# EAGLE schematic fmcboard_v1.6s (EAGLE 9.6.2)

## Sheet 1 of 5: Power, IO, Arduino
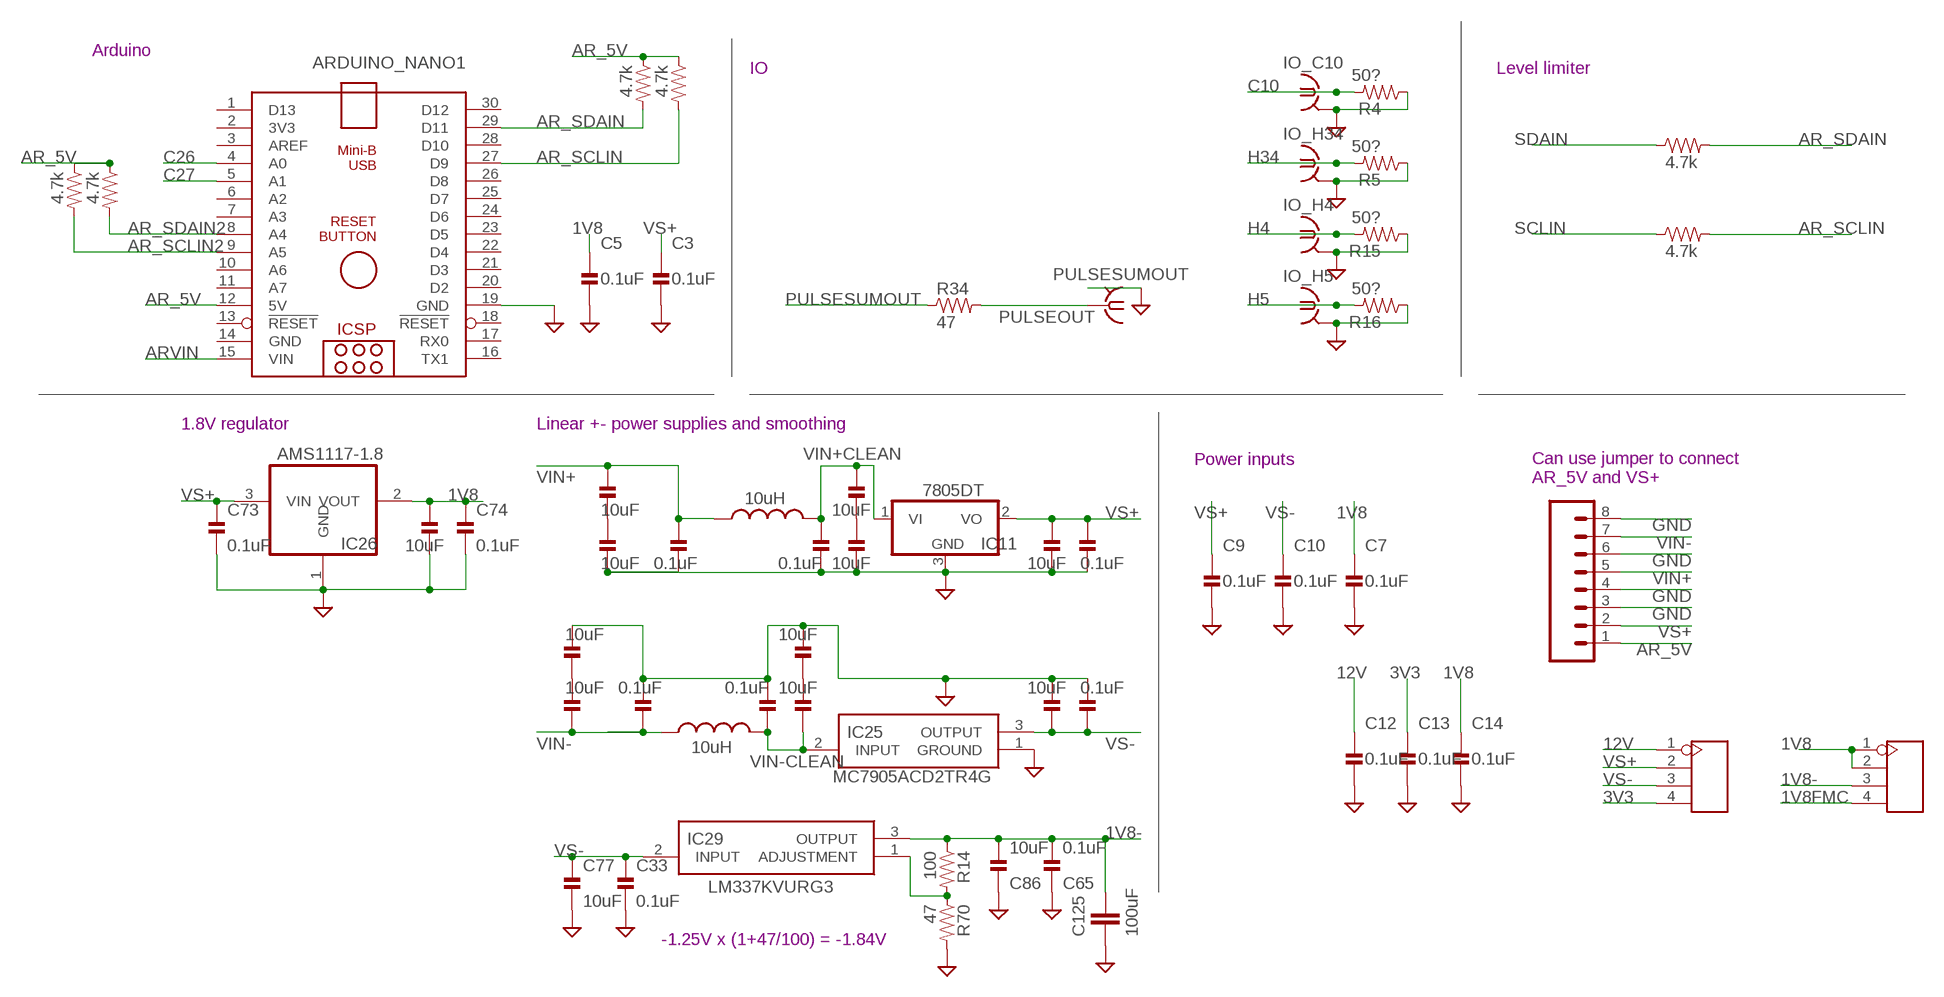
[diagram p0: schematic, sheet 1]

### Parts
ARDUINO_NANO1  1  ARDUINO_NANO  [ARDUINO_NANO]
C1  10uF  CAPACITOR0402_CAP  [0402_CAP]
C2  10uF  CAPACITOR0402_CAP  [0402_CAP]
C3  0.1uF  CAPACITOR0402_CAP  [0402_CAP]
C5  0.1uF  CAPACITOR0402_CAP  [0402_CAP]
C7  0.1uF  CAPACITOR0402_CAP  [0402_CAP]
C9  0.1uF  CAPACITOR0402_CAP  [0402_CAP]
C10  0.1uF  CAPACITOR0402_CAP  [0402_CAP]
C12  0.1uF  CAPACITOR0402_CAP  [0402_CAP]
C13  0.1uF  CAPACITOR0402_CAP  [0402_CAP]
C14  0.1uF  CAPACITOR0402_CAP  [0402_CAP]
C33  0.1uF  CAPACITOR0402_CAP  [0402_CAP]
C34  10uF  CAPACITOR0402_CAP  [0402_CAP]
C38  10uF  CAPACITOR0402_CAP  [0402_CAP]
C39  10uF  CAPACITOR0402_CAP  [0402_CAP]
C40  10uF  CAPACITOR0402_CAP  [0402_CAP]
C41  10uF  CAPACITOR0402_CAP  [0402_CAP]
C42  0.1uF  CAPACITOR0402_CAP  [0402_CAP]
C43  0.1uF  CAPACITOR0402_CAP  [0402_CAP]
C44  0.1uF  CAPACITOR0402_CAP  [0402_CAP]
C45  0.1uF  CAPACITOR0402_CAP  [0402_CAP]
C46  0.1uF  CAPACITOR0402_CAP  [0402_CAP]
C47  0.1uF  CAPACITOR0402_CAP  [0402_CAP]
C65  0.1uF  CAPACITOR0402_CAP  [0402_CAP]
C73  0.1uF  CAPACITOR0402_CAP  [0402_CAP]
C74  0.1uF  CAPACITOR0402_CAP  [0402_CAP]
C77  10uF  CAPACITOR0402_CAP  [0402_CAP]
C86  10uF  CAPACITOR0402_CAP  [0402_CAP]
C110  10uF  CAPACITOR0402_CAP  [0402_CAP]
C111  10uF  CAPACITOR0402_CAP  [0402_CAP]
C118  10uF  CAPACITOR0402_CAP  [0402_CAP]
C119  10uF  CAPACITOR0402_CAP  [0402_CAP]
C125  100uF  C-EUC1206K  [C1206K]
IC11  7805DT  [TO252]
IC25  MC7905ACD2TR4G  [MC7905ACD2TR4G]
IC26  AMS1117-1.8  REG1117  [SOT223]
IC29  LM337KVURG3  [LM337KVURG3]
IO_C10  BU-SMB-V  [BU-SMB-V]
IO_H4  BU-SMB-V  [BU-SMB-V]
IO_H5  BU-SMB-V  [BU-SMB-V]
IO_H34  BU-SMB-V  [BU-SMB-V]
J1  8pin  CONN_08"  [1X08]
J8  4p-2.54  DIP-BLACK-FEMALE-HEADER-VERT(4P-2.54)  [H4-2.54]
J12  4p-2.54  DIP-BLACK-FEMALE-HEADER-VERT(4P-2.54)  [H4-2.54]
L1  10uH  INDUCTOR1210  [1210]
L2  10uH  INDUCTOR1210  [1210]
PULSESUMOUT  BU-SMB-V  [BU-SMB-V]
R4  50?  RESISTOR0402_RES  [0402_RES]
R5  50?  RESISTOR0402_RES  [0402_RES]
R14  100  RESISTOR0402_RES  [0402_RES]
R15  50?  RESISTOR0402_RES  [0402_RES]
R16  50?  RESISTOR0402_RES  [0402_RES]
R34  47  RESISTOR0402_RES  [0402_RES]
R48  4.7k  RESISTOR0402_RES  [0402_RES]
R49  4.7k  RESISTOR0402_RES  [0402_RES]
R50  4.7k  RESISTOR0402_RES  [0402_RES]
R51  4.7k  RESISTOR0402_RES  [0402_RES]
R70  47  RESISTOR0402_RES  [0402_RES]
R87  4.7k  RESISTOR0402_RES  [0402_RES]
R90  4.7k  RESISTOR0402_RES  [0402_RES]

### Nets
1V8 [power]: C5.1 C7.1 C14.1 C34.1 C74.1 IC26.2(VOUT) J12.1 J12.2 ; also sheet 2,3
1V8-: C65.1 C86.1 C125.1 IC29.3(OUTPUT) J12.3 R14.1 ; also sheet 2
1V8FMC [power]: J12.4 ; also sheet 4
3V3 [power]: C13.1 J8.4 ; also sheet 4
12V [power]: C12.1 J8.1 ; also sheet 4,5
AR_5V [power]: ARDUINO_NANO1.12(5V) J1.1 R48.1 R49.1 R50.1 R51.1
AR_SCLIN: ARDUINO_NANO1.27(D9) R51.2 R90.2
AR_SCLIN2: ARDUINO_NANO1.9(A5) R49.2 ; also sheet 2
AR_SDAIN: ARDUINO_NANO1.29(D11) R50.2 R87.2
AR_SDAIN2: ARDUINO_NANO1.8(A4) R48.2 ; also sheet 2
ARVIN: ARDUINO_NANO1.15(VIN)
C10: IO_C10.1 R4.2 ; also sheet 2,4
C26: ARDUINO_NANO1.4(A0) ; also sheet 4
C27: ARDUINO_NANO1.5(A1) ; also sheet 4
GND [gnd]: ARDUINO_NANO1.19(GND) C1.2 C3.2 C5.2 C7.2 C9.2 C10.2 C12.2 C13.2 C14.2 C33.2 C34.2 C38.2 C39.1 C40.1 C42.2 C43.2 C44.1 C45.1 C46.1 C47.2 C65.2 C73.2 C74.2 C77.2 C86.2 C110.2 C119.1 C125.2 IC11.3(GND) IC25.1(GROUND) IC26.1(GND) IO_C10.2 IO_C10.3 IO_C10.4 IO_C10.5 IO_H4.2 IO_H4.3 IO_H4.4 IO_H4.5 IO_H5.2 IO_H5.3 IO_H5.4 IO_H5.5 IO_H34.2 IO_H34.3 IO_H34.4 IO_H34.5 J1.3 J1.4 J1.6 J1.8 PULSESUMOUT.2 PULSESUMOUT.3 PULSESUMOUT.4 PULSESUMOUT.5 R4.1 R5.1 R15.1 R16.1 R70.2 ; also sheet 2,3,4,5
H4: IO_H4.1 R15.2 ; also sheet 4
H5: IO_H5.1 R16.2 ; also sheet 4
H34: IO_H34.1 R5.2 ; also sheet 2,4
N$30: IC29.1(ADJUSTMENT) R14.2 R70.1
N$38: C1.1 C118.2
N$39: C41.1 C119.2
N$58: C2.2 C110.1
N$59: C40.2 C111.1
PULSEOUT: PULSESUMOUT.1 R34.2 ; also sheet 3
PULSESUMOUT: R34.1 ; also sheet 3
SCLIN: R90.1 ; also sheet 4
SDAIN [power]: R87.1 ; also sheet 4
VIN+ [power]: C42.1 C118.1 J1.5 L1.1 ; also sheet 5
VIN+CLEAN [power]: C2.1 C43.1 IC11.1(VI) L1.2
VIN- [power]: C41.2 C44.2 J1.7 L2.1 ; also sheet 5
VIN-CLEAN [power]: C45.2 C111.2 IC25.2(INPUT) L2.2
VS+ [power]: C3.1 C9.1 C38.1 C47.1 C73.1 IC11.2(VO) IC26.3(VIN) J1.2 J8.2 ; also sheet 2,3
VS- [power]: C10.1 C33.1 C39.2 C46.2 C77.1 IC25.3(OUTPUT) IC29.2(INPUT) J8.3 ; also sheet 2,3
Unconnected: ARDUINO_NANO1.1(D13) ARDUINO_NANO1.2(3V3) ARDUINO_NANO1.3(AREF) ARDUINO_NANO1.6(A2) ARDUINO_NANO1.7(A3) ARDUINO_NANO1.10(A6) ARDUINO_NANO1.11(A7) ARDUINO_NANO1.13(!RESET) ARDUINO_NANO1.16(TX1) ARDUINO_NANO1.17(RX0) ARDUINO_NANO1.18(!RESET) ARDUINO_NANO1.20(D2) ARDUINO_NANO1.21(D3) ARDUINO_NANO1.22(D4) ARDUINO_NANO1.23(D5) ARDUINO_NANO1.24(D6) ARDUINO_NANO1.25(D7) ARDUINO_NANO1.26(D8) ARDUINO_NANO1.28(D10) ARDUINO_NANO1.30(D12)

### Notes on the sheet
- Arduino
- IO | Level limiter
- 1.8V regulator | Linear +- power supplies and smoothing
- Power inputs
- Can use jumper to connect 
  AR_5V and VS+
- -1.25V x (1+47/100) = -1.84V

## Sheet 2 of 5: Pulse generator
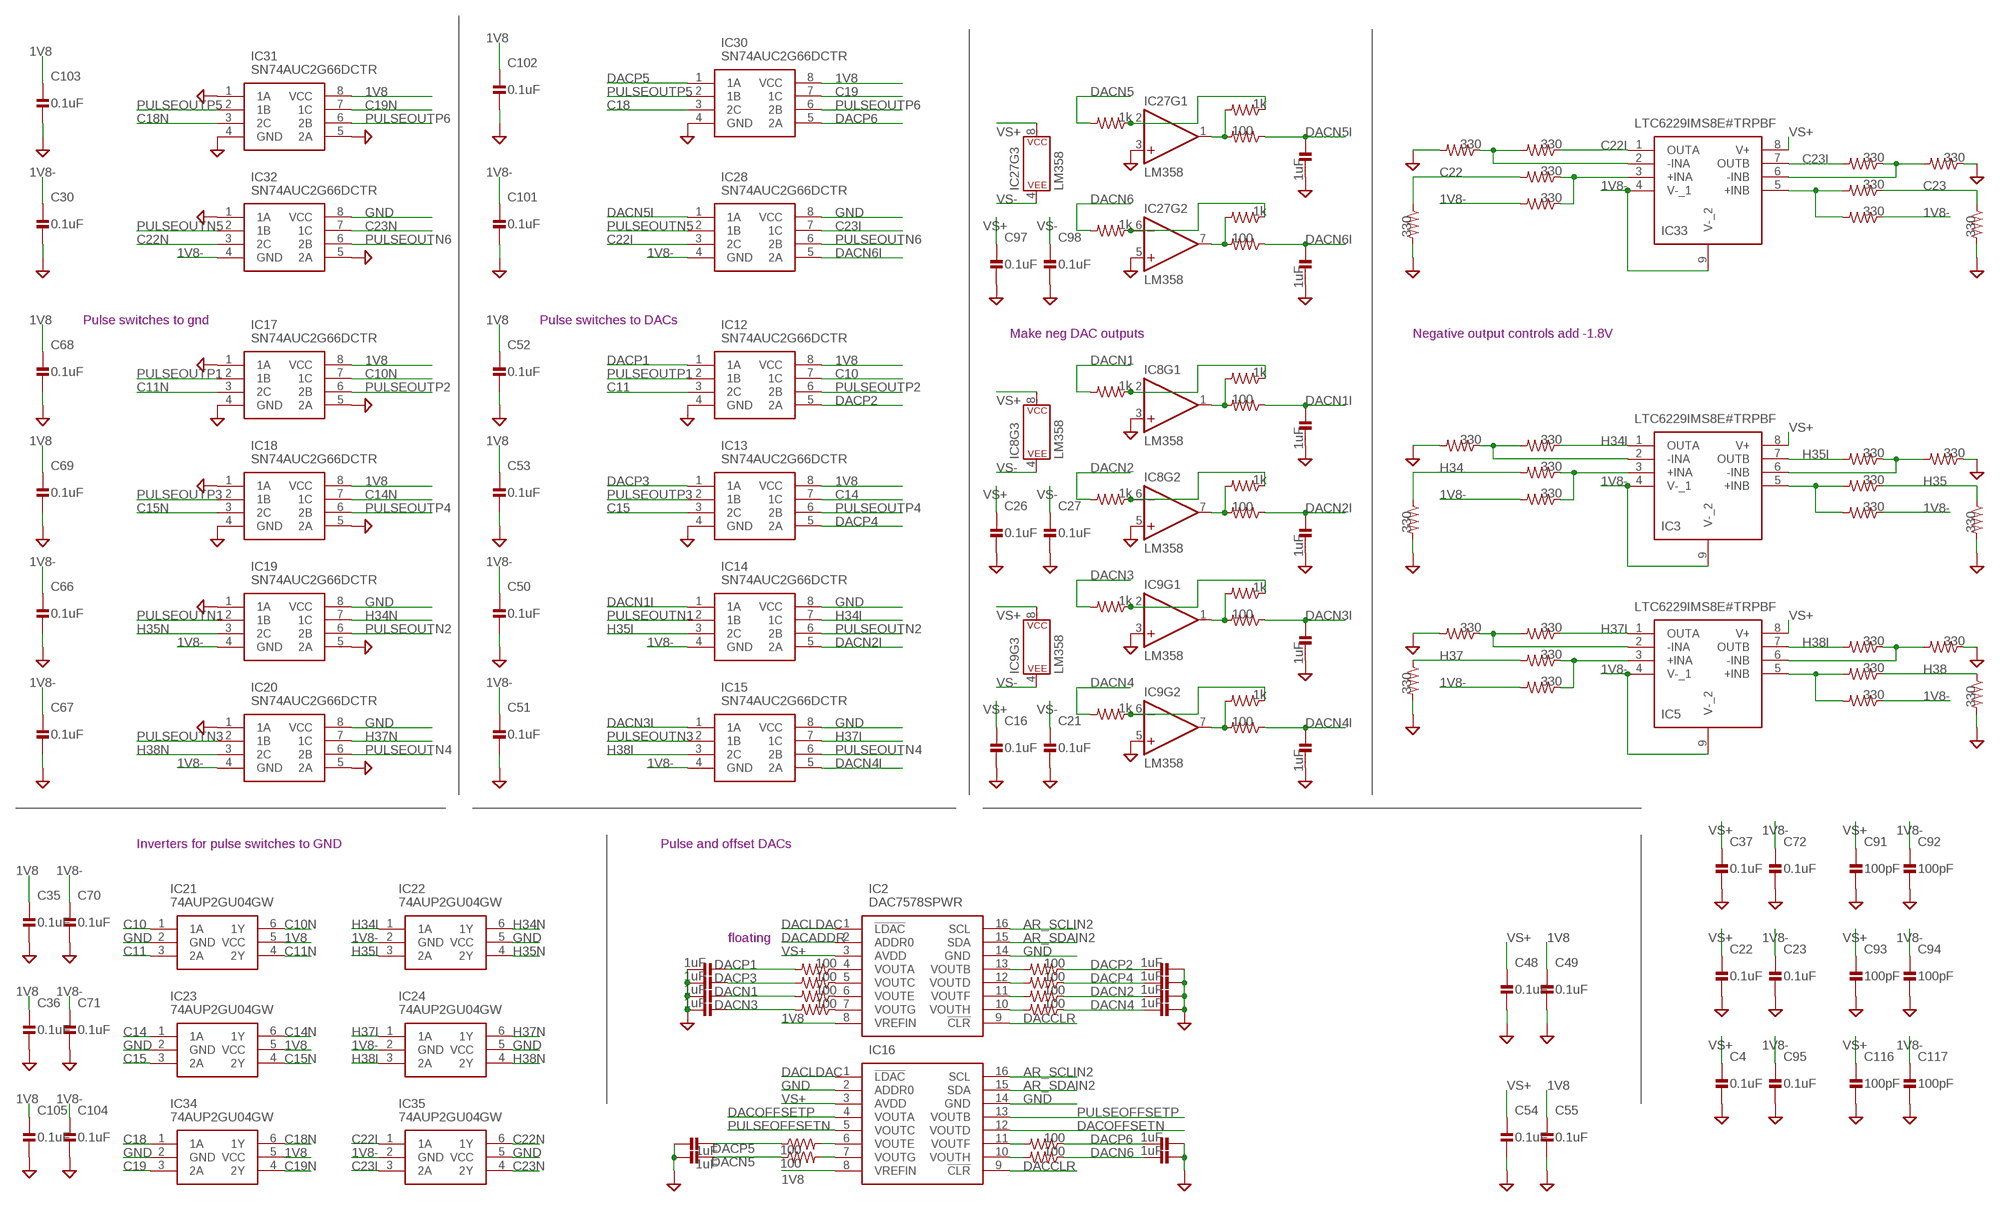
[diagram p1: schematic, sheet 2]

### Parts
C4  0.1uF  CAPACITOR0402_CAP  [0402_CAP]
C16  0.1uF  CAPACITOR0402_CAP  [0402_CAP]
C17  1uF  CAPACITOR0402_CAP  [0402_CAP]
C18  1uF  CAPACITOR0402_CAP  [0402_CAP]
C19  1uF  CAPACITOR0402_CAP  [0402_CAP]
C20  1uF  CAPACITOR0402_CAP  [0402_CAP]
C21  0.1uF  CAPACITOR0402_CAP  [0402_CAP]
C22  0.1uF  CAPACITOR0402_CAP  [0402_CAP]
C23  0.1uF  CAPACITOR0402_CAP  [0402_CAP]
C26  0.1uF  CAPACITOR0402_CAP  [0402_CAP]
C27  0.1uF  CAPACITOR0402_CAP  [0402_CAP]
C30  0.1uF  CAPACITOR0402_CAP  [0402_CAP]
C31  1uF  CAPACITOR0402_CAP  [0402_CAP]
C35  0.1uF  CAPACITOR0402_CAP  [0402_CAP]
C36  0.1uF  CAPACITOR0402_CAP  [0402_CAP]
C37  0.1uF  CAPACITOR0402_CAP  [0402_CAP]
C48  0.1uF  CAPACITOR0402_CAP  [0402_CAP]
C49  0.1uF  CAPACITOR0402_CAP  [0402_CAP]
C50  0.1uF  CAPACITOR0402_CAP  [0402_CAP]
C51  0.1uF  CAPACITOR0402_CAP  [0402_CAP]
C52  0.1uF  CAPACITOR0402_CAP  [0402_CAP]
C53  0.1uF  CAPACITOR0402_CAP  [0402_CAP]
C54  0.1uF  CAPACITOR0402_CAP  [0402_CAP]
C55  0.1uF  CAPACITOR0402_CAP  [0402_CAP]
C56  1uF  CAPACITOR0402_CAP  [0402_CAP]
C57  1uF  CAPACITOR0402_CAP  [0402_CAP]
C58  1uF  CAPACITOR0402_CAP  [0402_CAP]
C59  1uF  CAPACITOR0402_CAP  [0402_CAP]
C60  1uF  CAPACITOR0402_CAP  [0402_CAP]
C61  1uF  CAPACITOR0402_CAP  [0402_CAP]
C62  1uF  CAPACITOR0402_CAP  [0402_CAP]
C63  1uF  CAPACITOR0402_CAP  [0402_CAP]
C66  0.1uF  CAPACITOR0402_CAP  [0402_CAP]
C67  0.1uF  CAPACITOR0402_CAP  [0402_CAP]
C68  0.1uF  CAPACITOR0402_CAP  [0402_CAP]
C69  0.1uF  CAPACITOR0402_CAP  [0402_CAP]
C70  0.1uF  CAPACITOR0402_CAP  [0402_CAP]
C71  0.1uF  CAPACITOR0402_CAP  [0402_CAP]
C72  0.1uF  CAPACITOR0402_CAP  [0402_CAP]
C89  1uF  CAPACITOR0402_CAP  [0402_CAP]
C90  1uF  CAPACITOR0402_CAP  [0402_CAP]
C91  100pF  CAPACITOR0402_CAP  [0402_CAP]
C92  100pF  CAPACITOR0402_CAP  [0402_CAP]
C93  100pF  CAPACITOR0402_CAP  [0402_CAP]
C94  100pF  CAPACITOR0402_CAP  [0402_CAP]
C95  0.1uF  CAPACITOR0402_CAP  [0402_CAP]
C96  1uF  CAPACITOR0402_CAP  [0402_CAP]
C97  0.1uF  CAPACITOR0402_CAP  [0402_CAP]
C98  0.1uF  CAPACITOR0402_CAP  [0402_CAP]
C99  1uF  CAPACITOR0402_CAP  [0402_CAP]
C100  1uF  CAPACITOR0402_CAP  [0402_CAP]
C101  0.1uF  CAPACITOR0402_CAP  [0402_CAP]
C102  0.1uF  CAPACITOR0402_CAP  [0402_CAP]
C103  0.1uF  CAPACITOR0402_CAP  [0402_CAP]
C104  0.1uF  CAPACITOR0402_CAP  [0402_CAP]
C105  0.1uF  CAPACITOR0402_CAP  [0402_CAP]
C116  100pF  CAPACITOR0402_CAP  [0402_CAP]
C117  100pF  CAPACITOR0402_CAP  [0402_CAP]
IC2  DAC7578SPWR  [SOP65P640X120-16N]
IC3  LTC6229IMS8E#TRPBF  [SOP65P490X110-9N]
IC5  LTC6229IMS8E#TRPBF  [SOP65P490X110-9N]
IC8  LM358  OPAMP-DUALU  [SO08]
IC9  LM358  OPAMP-DUALU  [SO08]
IC12  SN74AUC2G66DCTR  [SOP65P400X130-8N]
IC13  SN74AUC2G66DCTR  [SOP65P400X130-8N]
IC14  SN74AUC2G66DCTR  [SOP65P400X130-8N]
IC15  SN74AUC2G66DCTR  [SOP65P400X130-8N]
IC16  DAC7578SPWR  [SOP65P640X120-16N]
IC17  SN74AUC2G66DCTR  [SOP65P400X130-8N]
IC18  SN74AUC2G66DCTR  [SOP65P400X130-8N]
IC19  SN74AUC2G66DCTR  [SOP65P400X130-8N]
IC20  SN74AUC2G66DCTR  [SOP65P400X130-8N]
IC21  74AUP2GU04GW  74AUP2GU04GW,125  [SOT65P210X110-6N]
IC22  74AUP2GU04GW  74AUP2GU04GW,125  [SOT65P210X110-6N]
IC23  74AUP2GU04GW  74AUP2GU04GW,125  [SOT65P210X110-6N]
IC24  74AUP2GU04GW  74AUP2GU04GW,125  [SOT65P210X110-6N]
IC27  LM358  OPAMP-DUALU  [SO08]
IC28  SN74AUC2G66DCTR  [SOP65P400X130-8N]
IC30  SN74AUC2G66DCTR  [SOP65P400X130-8N]
IC31  SN74AUC2G66DCTR  [SOP65P400X130-8N]
IC32  SN74AUC2G66DCTR  [SOP65P400X130-8N]
IC33  LTC6229IMS8E#TRPBF  [SOP65P490X110-9N]
IC34  74AUP2GU04GW  74AUP2GU04GW,125  [SOT65P210X110-6N]
IC35  74AUP2GU04GW  74AUP2GU04GW,125  [SOT65P210X110-6N]
R21  330  RESISTOR0402_RES  [0402_RES]
R22  330  RESISTOR0402_RES  [0402_RES]
R23  330  RESISTOR0402_RES  [0402_RES]
R24  330  RESISTOR0402_RES  [0402_RES]
R27  330  RESISTOR0402_RES  [0402_RES]
R28  330  RESISTOR0402_RES  [0402_RES]
R29  330  RESISTOR0402_RES  [0402_RES]
R30  330  RESISTOR0402_RES  [0402_RES]
R37  330  RESISTOR0402_RES  [0402_RES]
R39  330  RESISTOR0402_RES  [0402_RES]
R41  330  RESISTOR0402_RES  [0402_RES]
R43  330  RESISTOR0402_RES  [0402_RES]
R44  330  RESISTOR0402_RES  [0402_RES]
R45  330  RESISTOR0402_RES  [0402_RES]
R46  330  RESISTOR0402_RES  [0402_RES]
R47  100  RESISTOR0402_RES  [0402_RES]
R52  330  RESISTOR0402_RES  [0402_RES]
R53  100  RESISTOR0402_RES  [0402_RES]
R54  100  RESISTOR0402_RES  [0402_RES]
R55  100  RESISTOR0402_RES  [0402_RES]
R56  100  RESISTOR0402_RES  [0402_RES]
R57  100  RESISTOR0402_RES  [0402_RES]
R58  100  RESISTOR0402_RES  [0402_RES]
R59  100  RESISTOR0402_RES  [0402_RES]
R62  1k  RESISTOR0402_RES  [0402_RES]
R63  1k  RESISTOR0402_RES  [0402_RES]
R64  1k  RESISTOR0402_RES  [0402_RES]
R65  1k  RESISTOR0402_RES  [0402_RES]
R66  1k  RESISTOR0402_RES  [0402_RES]
R67  1k  RESISTOR0402_RES  [0402_RES]
R68  1k  RESISTOR0402_RES  [0402_RES]
R69  1k  RESISTOR0402_RES  [0402_RES]
R74  100  RESISTOR0402_RES  [0402_RES]
R75  100  RESISTOR0402_RES  [0402_RES]
R76  100  RESISTOR0402_RES  [0402_RES]
R77  100  RESISTOR0402_RES  [0402_RES]
R80  330  RESISTOR0402_RES  [0402_RES]
R81  330  RESISTOR0402_RES  [0402_RES]
R82  330  RESISTOR0402_RES  [0402_RES]
R83  330  RESISTOR0402_RES  [0402_RES]
R91  330  RESISTOR0402_RES  [0402_RES]
R92  100  RESISTOR0402_RES  [0402_RES]
R93  100  RESISTOR0402_RES  [0402_RES]
R94  100  RESISTOR0402_RES  [0402_RES]
R95  100  RESISTOR0402_RES  [0402_RES]
R96  1k  RESISTOR0402_RES  [0402_RES]
R97  1k  RESISTOR0402_RES  [0402_RES]
R98  1k  RESISTOR0402_RES  [0402_RES]
R99  1k  RESISTOR0402_RES  [0402_RES]
R100  100  RESISTOR0402_RES  [0402_RES]
R101  100  RESISTOR0402_RES  [0402_RES]
R102  330  RESISTOR0402_RES  [0402_RES]
R103  330  RESISTOR0402_RES  [0402_RES]
R104  330  RESISTOR0402_RES  [0402_RES]
R105  330  RESISTOR0402_RES  [0402_RES]
R106  330  RESISTOR0402_RES  [0402_RES]
R107  330  RESISTOR0402_RES  [0402_RES]
R108  330  RESISTOR0402_RES  [0402_RES]
R109  330  RESISTOR0402_RES  [0402_RES]
R110  330  RESISTOR0402_RES  [0402_RES]

### Nets
1V8 [power]: C35.1 C36.1 C49.1 C52.1 C53.1 C55.1 C68.1 C69.1 C102.1 C103.1 C105.1 IC2.8(VREFIN) IC12.8(VCC) IC13.8(VCC) IC16.8(VREFIN) IC17.8(VCC) IC18.8(VCC) IC21.5(VCC) IC23.5(VCC) IC30.8(VCC) IC31.8(VCC) IC34.5(VCC) ; also sheet 1,3
1V8-: C23.1 C30.1 C50.1 C51.1 C66.1 C67.1 C70.1 C71.1 C72.1 C92.1 C94.1 C95.1 C101.1 C104.1 C117.1 IC3.4(V-_1) IC3.9(V-_2) IC5.4(V-_1) IC5.9(V-_2) IC14.4(GND) IC15.4(GND) IC19.4(GND) IC20.4(GND) IC22.2(GND) IC24.2(GND) IC28.4(GND) IC32.4(GND) IC33.4(V-_1) IC33.9(V-_2) IC35.2(GND) R22.2 R28.1 R39.2 R45.1 R102.2 R106.1 ; also sheet 1
AR_SCLIN2: IC2.16(SCL) IC16.16(SCL) ; also sheet 1
AR_SDAIN2: IC2.15(SDA) IC16.15(SDA) ; also sheet 1
C10: IC12.7(1C) IC21.1(1A) ; also sheet 1,4
C10N: IC17.7(1C) IC21.6(1Y)
C11: IC12.3(2C) IC21.3(2A) ; also sheet 4
C11N: IC17.3(2C) IC21.4(2Y)
C14: IC13.7(1C) IC23.1(1A) ; also sheet 4
C14N: IC18.7(1C) IC23.6(1Y)
C15: IC13.3(2C) IC23.3(2A) ; also sheet 4
C15N: IC18.3(2C) IC23.4(2Y)
C18: IC30.3(2C) IC34.1(1A) ; also sheet 4
C18N: IC31.3(2C) IC34.6(1Y)
C19: IC30.7(1C) IC34.3(2A) ; also sheet 4
C19N: IC31.7(1C) IC34.4(2Y)
C22: R91.2 R109.1 ; also sheet 4
C22I: IC28.3(2C) IC33.1(OUTA) IC35.1(1A) R103.1
C22N: IC32.3(2C) IC35.6(1Y)
C23: R105.1 R110.1 ; also sheet 4
C23I: IC28.7(1C) IC33.7(OUTB) IC35.3(2A) R107.2
C23N: IC32.7(1C) IC35.4(2Y)
DACADDR: IC2.2(ADDR0)
DACCLR: IC2.9(!CLR) IC16.9(!CLR)
DACLDAC: IC2.1(!LDAC) IC16.1(!LDAC)
DACN1: C57.2 R54.2 R64.2
DACN1I: C17.2 IC14.1(1A) R74.1
DACN2: C61.1 R58.1 R65.2
DACN2I: C18.2 IC14.5(2A) R75.1
DACN3: C56.2 R55.2 R68.2
DACN3I: C19.2 IC15.1(1A) R76.1
DACN4: C60.1 R59.1 R69.2
DACN4I: C20.2 IC15.5(2A) R77.1
DACN5: C96.1 R95.1 R98.2
DACN5I: C99.2 IC28.1(1A) R100.1
DACN6: C89.1 R93.1 R99.2
DACN6I: C100.2 IC28.5(2A) R101.1
DACOFFSETN: IC16.12(VOUTD) ; also sheet 3
DACOFFSETP: IC16.4(VOUTA) ; also sheet 3
DACP1: C59.2 IC12.1(1A) R47.2
DACP2: C63.1 IC12.5(2A) R56.1
DACP3: C58.2 IC13.1(1A) R53.2
DACP4: C62.1 IC13.5(2A) R57.1
DACP5: C90.1 IC30.1(1A) R94.1
DACP6: C31.1 IC30.5(2A) R92.1
GND [gnd]: C4.2 C16.2 C17.1 C18.1 C19.1 C20.1 C21.2 C22.2 C23.2 C26.2 C27.2 C30.2 C31.2 C35.2 C36.2 C37.2 C48.2 C49.2 C50.2 C51.2 C52.2 C53.2 C54.2 C55.2 C56.1 C57.1 C58.1 C59.1 C60.2 C61.2 C62.2 C63.2 C66.2 C67.2 C68.2 C69.2 C70.2 C71.2 C72.2 C89.2 C90.2 C91.2 C92.2 C93.2 C94.2 C95.2 C96.2 C97.2 C98.2 C99.1 C100.1 C101.2 C102.2 C103.2 C104.2 C105.2 C116.2 C117.2 IC2.14(GND) IC8.3(+IN) IC8.5(+IN) IC9.3(+IN) IC9.5(+IN) IC12.4(GND) IC13.4(GND) IC14.8(VCC) IC15.8(VCC) IC16.2(ADDR0) IC16.14(GND) IC17.1(1A) IC17.4(GND) IC17.5(2A) IC18.1(1A) IC18.4(GND) IC18.5(2A) IC19.1(1A) IC19.5(2A) IC19.8(VCC) IC20.1(1A) IC20.5(2A) IC20.8(VCC) IC21.2(GND) IC22.5(VCC) IC23.2(GND) IC24.5(VCC) IC27.3(+IN) IC27.5(+IN) IC28.8(VCC) IC30.4(GND) IC31.1(1A) IC31.4(GND) IC31.5(2A) IC32.1(1A) IC32.5(2A) IC32.8(VCC) IC34.2(GND) IC35.5(VCC) R24.2 R30.1 R43.2 R52.1 R80.2 R81.2 R82.2 R83.2 R104.2 R108.1 R109.2 R110.2 ; also sheet 1,3,4,5
H34: R21.2 R80.1 ; also sheet 1,4
H34I: IC3.1(OUTA) IC14.7(1C) IC22.1(1A) R23.1
H34N: IC19.7(1C) IC22.6(1Y)
H35: R27.1 R81.1 ; also sheet 4
H35I: IC3.7(OUTB) IC14.3(2C) IC22.3(2A) R29.2
H35N: IC19.3(2C) IC22.4(2Y)
H37: R37.2 R83.1 ; also sheet 4
H37I: IC5.1(OUTA) IC15.7(1C) IC24.1(1A) R41.1
H37N: IC20.7(1C) IC24.6(1Y)
H38: R44.1 R82.1 ; also sheet 4
H38I: IC5.7(OUTB) IC15.3(2C) IC24.3(2A) R46.2
H38N: IC20.3(2C) IC24.4(2Y)
N$1: IC33.2(-INA) R103.2 R104.1
N$4: IC3.6(-INB) R29.1 R30.2
N$5: IC3.5(+INB) R27.2 R28.2
N$6: IC5.2(-INA) R41.2 R43.1
N$7: IC3.3(+INA) R21.1 R22.1
N$12: IC5.6(-INB) R46.1 R52.2
N$13: IC3.2(-INA) R23.2 R24.1
N$14: IC5.3(+INA) R37.1 R39.1
N$15: IC5.5(+INB) R44.2 R45.2
N$16: IC8.7(OUT) R62.2 R75.2
N$17: IC8.1(OUT) R63.2 R74.2
N$18: IC16.11(VOUTF) R92.2
N$19: IC8.2(-IN) R63.1 R64.1
N$20: IC8.6(-IN) R62.1 R65.1
N$21: IC2.13(VOUTB) R56.2
N$22: IC2.4(VOUTA) R47.1
N$23: IC2.5(VOUTC) R53.1
N$24: IC2.6(VOUTE) R54.1
N$25: IC2.7(VOUTG) R55.1
N$26: IC2.12(VOUTD) R57.2
N$27: IC2.11(VOUTF) R58.2
N$28: IC2.10(VOUTH) R59.2
N$31: IC9.7(OUT) R66.2 R77.2
N$32: IC9.1(OUT) R67.2 R76.2
N$33: IC9.2(-IN) R67.1 R68.1
N$34: IC9.6(-IN) R66.1 R69.1
N$41: IC16.10(VOUTH) R93.2
N$43: IC16.6(VOUTE) R94.2
N$44: IC16.7(VOUTG) R95.2
N$45: IC27.7(OUT) R96.2 R101.2
N$46: IC27.1(OUT) R97.2 R100.2
N$47: IC27.2(-IN) R97.1 R98.1
N$48: IC27.6(-IN) R96.1 R99.1
N$49: IC33.6(-INB) R107.1 R108.2
N$50: IC33.3(+INA) R91.1 R102.1
N$51: IC33.5(+INB) R105.2 R106.2
PULSEOFFSETN: IC16.5(VOUTC) ; also sheet 3
PULSEOFFSETP: IC16.13(VOUTB) ; also sheet 3
PULSEOUTN1: IC14.2(1B) IC19.2(1B) ; also sheet 3
PULSEOUTN2: IC14.6(2B) IC19.6(2B) ; also sheet 3
PULSEOUTN3: IC15.2(1B) IC20.2(1B) ; also sheet 3
PULSEOUTN4: IC15.6(2B) IC20.6(2B) ; also sheet 3
PULSEOUTN5: IC28.2(1B) IC32.2(1B) ; also sheet 3
PULSEOUTN6: IC28.6(2B) IC32.6(2B) ; also sheet 3
PULSEOUTP1: IC12.2(1B) IC17.2(1B) ; also sheet 3
PULSEOUTP2: IC12.6(2B) IC17.6(2B) ; also sheet 3
PULSEOUTP3: IC13.2(1B) IC18.2(1B) ; also sheet 3
PULSEOUTP4: IC13.6(2B) IC18.6(2B) ; also sheet 3
PULSEOUTP5: IC30.2(1B) IC31.2(1B) ; also sheet 3
PULSEOUTP6: IC30.6(2B) IC31.6(2B) ; also sheet 3
VS+ [power]: C4.1 C16.1 C22.1 C26.1 C37.1 C48.1 C54.1 C91.1 C93.1 C97.1 C116.1 IC2.3(AVDD) IC3.8(V+) IC5.8(V+) IC8.8(P$V+) IC9.8(P$V+) IC16.3(AVDD) IC27.8(P$V+) IC33.8(V+) ; also sheet 1,3
VS- [power]: C21.1 C27.1 C98.1 IC8.4(P$V-) IC9.4(P$V-) IC27.4(P$V-) ; also sheet 1,3

### Notes on the sheet
- Pulse switches to gnd | Pulse switches to DACs
- Make neg DAC outputs | Negative output controls add -1.8V
- Inverters for pulse switches to GND | Pulse and offset DACs
- floating

## Sheet 3 of 5: Input amplifiers
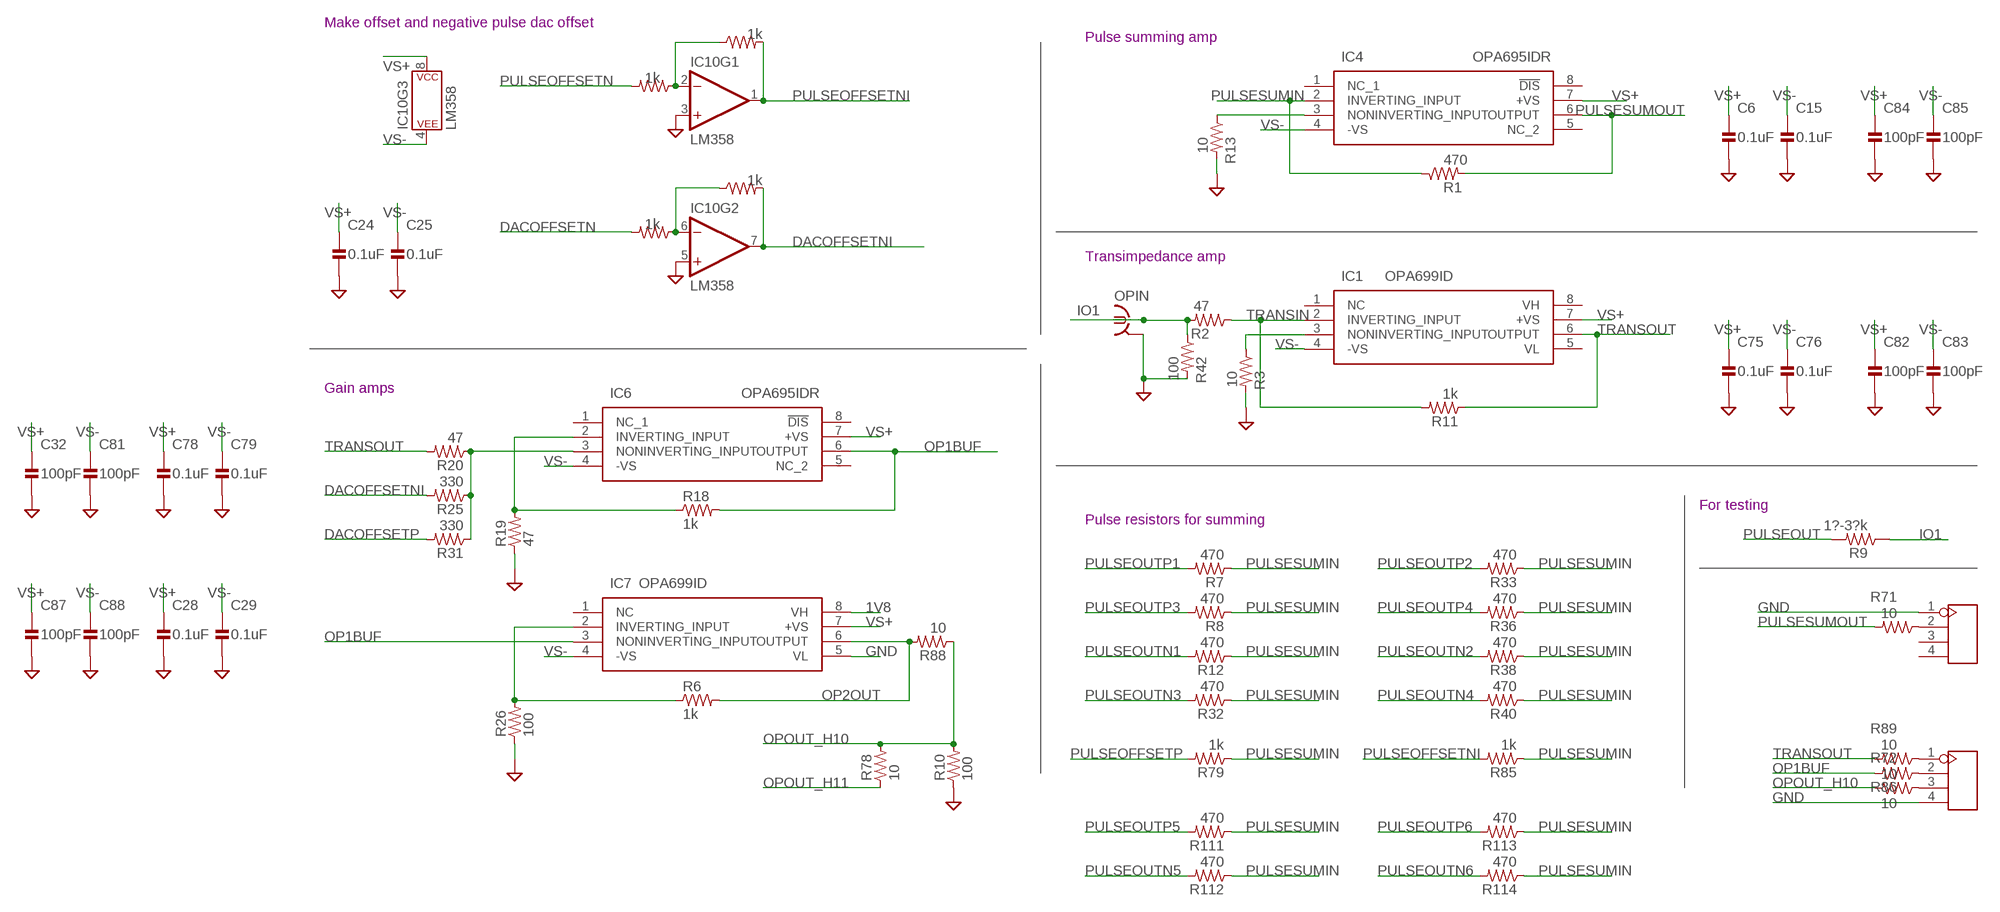
[diagram p2: schematic, sheet 3]

### Parts
C6  0.1uF  CAPACITOR0402_CAP  [0402_CAP]
C15  0.1uF  CAPACITOR0402_CAP  [0402_CAP]
C24  0.1uF  CAPACITOR0402_CAP  [0402_CAP]
C25  0.1uF  CAPACITOR0402_CAP  [0402_CAP]
C28  0.1uF  CAPACITOR0402_CAP  [0402_CAP]
C29  0.1uF  CAPACITOR0402_CAP  [0402_CAP]
C32  100pF  CAPACITOR0402_CAP  [0402_CAP]
C75  0.1uF  CAPACITOR0402_CAP  [0402_CAP]
C76  0.1uF  CAPACITOR0402_CAP  [0402_CAP]
C78  0.1uF  CAPACITOR0402_CAP  [0402_CAP]
C79  0.1uF  CAPACITOR0402_CAP  [0402_CAP]
C81  100pF  CAPACITOR0402_CAP  [0402_CAP]
C82  100pF  CAPACITOR0402_CAP  [0402_CAP]
C83  100pF  CAPACITOR0402_CAP  [0402_CAP]
C84  100pF  CAPACITOR0402_CAP  [0402_CAP]
C85  100pF  CAPACITOR0402_CAP  [0402_CAP]
C87  100pF  CAPACITOR0402_CAP  [0402_CAP]
C88  100pF  CAPACITOR0402_CAP  [0402_CAP]
IC1  OPA699ID  [SOIC127P600X175-8N]
IC4  OPA695IDR  [SOIC127P600X175-8N]
IC6  OPA695IDR  [SOIC127P600X175-8N]
IC7  OPA699ID  [SOIC127P600X175-8N]
IC10  LM358  OPAMP-DUALU  [SO08]
J5  4p-2.54  DIP-BLACK-FEMALE-HEADER-VERT(4P-2.54)  [H4-2.54]
J13  4p-2.54  DIP-BLACK-FEMALE-HEADER-VERT(4P-2.54)  [H4-2.54]
OPIN  BU-SMB-V  [BU-SMB-V]
R1  470  RESISTOR0402_RES  [0402_RES]
R2  47  RESISTOR0402_RES  [0402_RES]
R3  10  RESISTOR0402_RES  [0402_RES]
R6  1k  RESISTOR0402_RES  [0402_RES]
R7  470  RESISTOR0402_RES  [0402_RES]
R8  470  RESISTOR0402_RES  [0402_RES]
R9  1?-3?k  R-US_R0805  [R0805]
R10  100  RESISTOR0402_RES  [0402_RES]
R11  1k  RESISTOR0402_RES  [0402_RES]
R12  470  RESISTOR0402_RES  [0402_RES]
R13  10  RESISTOR0402_RES  [0402_RES]
R17  1k  RESISTOR0402_RES  [0402_RES]
R18  1k  RESISTOR0402_RES  [0402_RES]
R19  47  RESISTOR0402_RES  [0402_RES]
R20  47  RESISTOR0402_RES  [0402_RES]
R25  330  RESISTOR0402_RES  [0402_RES]
R26  100  RESISTOR0402_RES  [0402_RES]
R31  330  RESISTOR0402_RES  [0402_RES]
R32  470  RESISTOR0402_RES  [0402_RES]
R33  470  RESISTOR0402_RES  [0402_RES]
R35  1k  RESISTOR0402_RES  [0402_RES]
R36  470  RESISTOR0402_RES  [0402_RES]
R38  470  RESISTOR0402_RES  [0402_RES]
R40  470  RESISTOR0402_RES  [0402_RES]
R42  100  RESISTOR0402_RES  [0402_RES]
R61  1k  RESISTOR0402_RES  [0402_RES]
R71  10  RESISTOR0402_RES  [0402_RES]
R72  10  RESISTOR0402_RES  [0402_RES]
R78  10  RESISTOR0402_RES  [0402_RES]
R79  1k  RESISTOR0402_RES  [0402_RES]
R85  1k  RESISTOR0402_RES  [0402_RES]
R86  10  RESISTOR0402_RES  [0402_RES]
R88  10  RESISTOR0402_RES  [0402_RES]
R89  10  RESISTOR0402_RES  [0402_RES]
R111  470  RESISTOR0402_RES  [0402_RES]
R112  470  RESISTOR0402_RES  [0402_RES]
R113  470  RESISTOR0402_RES  [0402_RES]
R114  470  RESISTOR0402_RES  [0402_RES]
R115  1k  RESISTOR0402_RES  [0402_RES]

### Nets
1V8 [power]: IC7.8(VH) ; also sheet 1,2
DACOFFSETN: R17.2 ; also sheet 2
DACOFFSETNI: IC10.7(OUT) R25.2 R115.2
DACOFFSETP: R31.2 ; also sheet 2
GND [gnd]: C6.2 C15.2 C24.2 C25.2 C28.2 C29.2 C32.2 C75.2 C76.2 C78.2 C79.2 C81.2 C82.2 C83.2 C84.2 C85.2 C87.2 C88.2 IC7.5(VL) IC10.3(+IN) IC10.5(+IN) J5.4 J13.1 OPIN.2 OPIN.3 OPIN.4 OPIN.5 R3.2 R10.1 R13.2 R19.1 R26.1 R42.2 ; also sheet 1,2,4,5
IO1: OPIN.1 R2.2 R9.1 R42.1
N$2: IC10.6(-IN) R17.1 R115.1
N$3 [gnd]: IC1.3(NONINVERTING_INPUT) R3.1
N$8 [gnd]: IC4.3(NONINVERTING_INPUT) R13.1
N$9: IC6.2(INVERTING_INPUT) R18.1 R19.2
N$10: IC6.3(NONINVERTING_INPUT) R20.1 R25.1 R31.1
N$11: IC7.2(INVERTING_INPUT) R6.1 R26.2
N$35: J13.2 R71.1
N$36: J5.2 R72.1
N$37: IC10.2(-IN) R35.1 R61.1
N$40: J5.3 R86.1
N$42: J5.1 R89.1
OP1BUF: IC6.6(OUTPUT) IC7.3(NONINVERTING_INPUT) R18.2 R72.2
OP2OUT: IC7.6(OUTPUT) R6.2 R88.2
OPOUT_H10: R10.2 R78.2 R86.2 R88.1 ; also sheet 4
OPOUT_H11: R78.1 ; also sheet 4
PULSEOFFSETN: R61.2 ; also sheet 2
PULSEOFFSETNI: IC10.1(OUT) R35.2 R85.2
PULSEOFFSETP: R79.2 ; also sheet 2
PULSEOUT: R9.2 ; also sheet 1
PULSEOUTN1: R12.2 ; also sheet 2
PULSEOUTN2: R38.2 ; also sheet 2
PULSEOUTN3: R32.2 ; also sheet 2
PULSEOUTN4: R40.2 ; also sheet 2
PULSEOUTN5: R112.2 ; also sheet 2
PULSEOUTN6: R114.2 ; also sheet 2
PULSEOUTP1: R7.2 ; also sheet 2
PULSEOUTP2: R33.2 ; also sheet 2
PULSEOUTP3: R8.2 ; also sheet 2
PULSEOUTP4: R36.2 ; also sheet 2
PULSEOUTP5: R111.2 ; also sheet 2
PULSEOUTP6: R113.2 ; also sheet 2
PULSESUMIN: IC4.2(INVERTING_INPUT) R1.1 R7.1 R8.1 R12.1 R32.1 R33.1 R36.1 R38.1 R40.1 R79.1 R85.1 R111.1 R112.1 R113.1 R114.1
PULSESUMOUT: IC4.6(OUTPUT) R1.2 R71.2 ; also sheet 1
TRANSIN: IC1.2(INVERTING_INPUT) R2.1 R11.2
TRANSOUT: IC1.6(OUTPUT) R11.1 R20.2 R89.2
VS+ [power]: C6.1 C24.1 C28.1 C32.1 C75.1 C78.1 C82.1 C84.1 C87.1 IC1.7(+VS) IC4.7(+VS) IC6.7(+VS) IC7.7(+VS) IC10.8(P$V+) ; also sheet 1,2
VS- [power]: C15.1 C25.1 C29.1 C76.1 C79.1 C81.1 C83.1 C85.1 C88.1 IC1.4(-VS) IC4.4(-VS) IC6.4(-VS) IC7.4(-VS) IC10.4(P$V-) ; also sheet 1,2
Unconnected: IC1.1(NC) IC1.5(VL) IC1.8(VH) IC4.1(NC_1) IC4.5(NC_2) IC4.8(!DIS) IC6.1(NC_1) IC6.5(NC_2) IC6.8(!DIS) IC7.1(NC) J13.3 J13.4

### Notes on the sheet
- Make offset and negative pulse dac offset
- Pulse summing amp
- Transimpedance amp
- Gain amps
- For testing
- Pulse resistors for summing

## Sheet 4 of 5: FMC connections
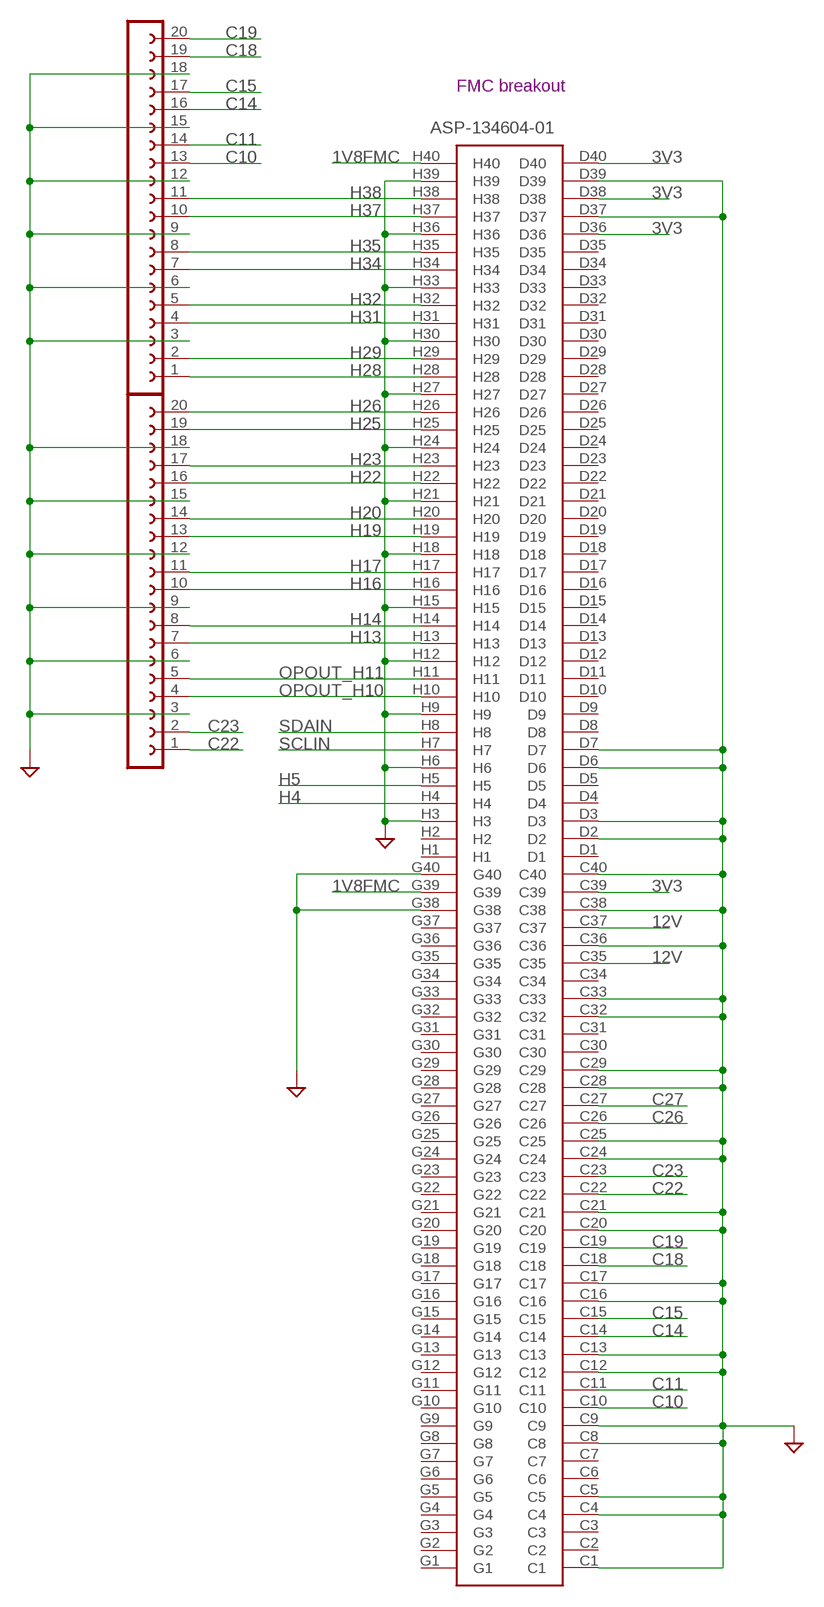
[diagram p3: schematic, sheet 4]

### Parts
J2  ASP-134604-01  [ASP13460401]
SV1  20  FE20-1  [FE20]
SV2  20  FE20-1  [FE20]

### Nets
1V8FMC [power]: J2.G39 J2.H40 ; also sheet 1
3V3 [power]: J2.C39 J2.D36 J2.D38 J2.D40 ; also sheet 1
12V [power]: J2.C35 J2.C37 ; also sheet 1,5
C10: J2.C10 SV2.13 ; also sheet 1,2
C11: J2.C11 SV2.14 ; also sheet 2
C14: J2.C14 SV2.16 ; also sheet 2
C15: J2.C15 SV2.17 ; also sheet 2
C18: J2.C18 SV2.19 ; also sheet 2
C19: J2.C19 SV2.20 ; also sheet 2
C22: J2.C22 SV1.1 ; also sheet 2
C23: J2.C23 SV1.2 ; also sheet 2
C26: J2.C26 ; also sheet 1
C27: J2.C27 ; also sheet 1
GND [gnd]: J2.C1 J2.C4 J2.C5 J2.C8 J2.C9 J2.C12 J2.C13 J2.C16 J2.C17 J2.C20 J2.C21 J2.C24 J2.C25 J2.C28 J2.C29 J2.C32 J2.C33 J2.C36 J2.C38 J2.C40 J2.D2 J2.D3 J2.D6 J2.D7 J2.D37 J2.D39 J2.G38 J2.G40 J2.H3 J2.H6 J2.H9 J2.H12 J2.H15 J2.H18 J2.H21 J2.H24 J2.H27 J2.H30 J2.H33 J2.H36 J2.H39 SV1.3 SV1.6 SV1.9 SV1.12 SV1.15 SV1.18 SV2.3 SV2.6 SV2.9 SV2.12 SV2.15 SV2.18 ; also sheet 1,2,3,5
H4: J2.H4 ; also sheet 1
H5: J2.H5 ; also sheet 1
H13: J2.H13 SV1.7
H14: J2.H14 SV1.8
H16: J2.H16 SV1.10
H17: J2.H17 SV1.11
H19: J2.H19 SV1.13
H20: J2.H20 SV1.14
H22: J2.H22 SV1.16
H23: J2.H23 SV1.17
H25: J2.H25 SV1.19
H26: J2.H26 SV1.20
H28: J2.H28 SV2.1
H29: J2.H29 SV2.2
H31: J2.H31 SV2.4
H32: J2.H32 SV2.5
H34: J2.H34 SV2.7 ; also sheet 1,2
H35: J2.H35 SV2.8 ; also sheet 2
H37: J2.H37 SV2.10 ; also sheet 2
H38: J2.H38 SV2.11 ; also sheet 2
OPOUT_H10: J2.H10 SV1.4 ; also sheet 3
OPOUT_H11: J2.H11 SV1.5 ; also sheet 3
SCLIN: J2.H7 ; also sheet 1
SDAIN [power]: J2.H8 ; also sheet 1
Unconnected: J2.C2 J2.C3 J2.C6 J2.C7 J2.C30 J2.C31 J2.C34 J2.D1 J2.D4 J2.D5 J2.D8 J2.D9 J2.D10 J2.D11 J2.D12 J2.D13 J2.D14 J2.D15 J2.D16 J2.D17 J2.D18 J2.D19 J2.D20 J2.D21 J2.D22 J2.D23 J2.D24 J2.D25 J2.D26 J2.D27 J2.D28 J2.D29 J2.D30 J2.D31 J2.D32 J2.D33 J2.D34 J2.D35 J2.G1 J2.G2 J2.G3 J2.G4 J2.G5 J2.G6 J2.G7 J2.G8 J2.G9 J2.G10 J2.G11 J2.G12 J2.G13 J2.G14 J2.G15 J2.G16 J2.G17 J2.G18 J2.G19 J2.G20 J2.G21 J2.G22 J2.G23 J2.G24 J2.G25 J2.G26 J2.G27 J2.G28 J2.G29 J2.G30 J2.G31 J2.G32 J2.G33 J2.G34 J2.G35 J2.G36 J2.G37 J2.H1 J2.H2

### Notes on the sheet
- FMC breakout

## Sheet 5 of 5: Power input
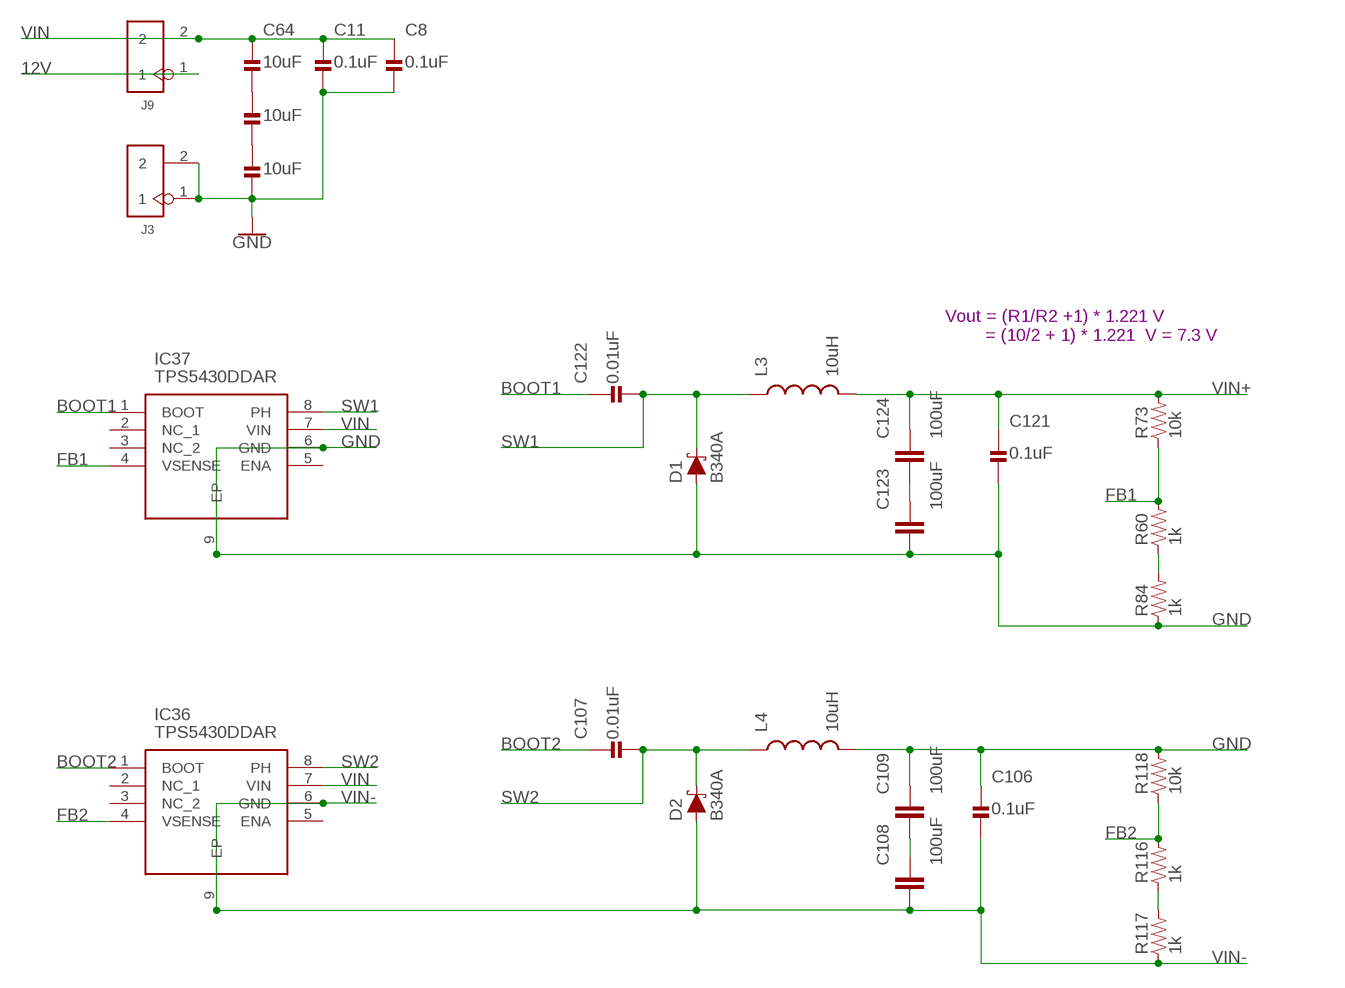
[diagram p4: schematic, sheet 5]

### Parts
C8  0.1uF  CAPACITOR0402_CAP  [0402_CAP]
C11  0.1uF  CAPACITOR0402_CAP  [0402_CAP]
C64  10uF  CAPACITOR0402_CAP  [0402_CAP]
C80  10uF  CAPACITOR0402_CAP  [0402_CAP]
C106  0.1uF  CAPACITOR0402_CAP  [0402_CAP]
C107  0.01uF  CAPACITOR0402_CAP  [0402_CAP]
C108  100uF  C-EUC1206K  [C1206K]
C109  100uF  C-EUC1206K  [C1206K]
C120  10uF  CAPACITOR0402_CAP  [0402_CAP]
C121  0.1uF  CAPACITOR0402_CAP  [0402_CAP]
C122  0.01uF  CAPACITOR0402_CAP  [0402_CAP]
C123  100uF  C-EUC1206K  [C1206K]
C124  100uF  C-EUC1206K  [C1206K]
D1  B340A  DIODE-SCHOTTKY-B340A  [SMA-DIODE]
D2  B340A  DIODE-SCHOTTKY-B340A  [SMA-DIODE]
IC36  TPS5430DDAR  [SOIC127P600X170-9N]
IC37  TPS5430DDAR  [SOIC127P600X170-9N]
J3  2p-2.54  DIP-BLACK-MALE-HEADER-VERT(2P-2.54)  [H2-2.54]
J9  2p-2.54  DIP-BLACK-MALE-HEADER-VERT(2P-2.54)  [H2-2.54]
L3  10uH  INDUCTORPWR  [CDRH125]
L4  10uH  INDUCTORPWR  [CDRH125]
R60  1k  RESISTOR0402_RES  [0402_RES]
R73  10k  RESISTOR0402_RES  [0402_RES]
R84  1k  RESISTOR0402_RES  [0402_RES]
R116  1k  RESISTOR0402_RES  [0402_RES]
R117  1k  RESISTOR0402_RES  [0402_RES]
R118  10k  RESISTOR0402_RES  [0402_RES]

### Nets
12V [power]: J9.1 ; also sheet 1,4
BOOT1: C122.1 IC37.1(BOOT)
BOOT2: C107.1 IC36.1(BOOT)
FB1: IC37.4(VSENSE) R60.2 R73.1
FB2: IC36.4(VSENSE) R116.2 R118.1
GND [gnd]: C8.2 C11.2 C80.2 C106.1 C109.1 C121.2 C123.2 D1.A IC37.6(GND) IC37.9(EP) J3.1 J3.2 L4.2 R84.1 R118.2 ; also sheet 1,2,3,4
N$29: C64.2 C120.1
N$52: C80.1 C120.2
N$53: C123.1 C124.2
N$54 [gnd]: R60.1 R84.2
N$55: C108.1 C109.2
N$56: R116.1 R117.2
SW1: C122.2 D1.C IC37.8(PH) L3.1
SW2: C107.2 D2.C IC36.8(PH) L4.1
VIN: C8.1 C11.1 C64.1 IC36.7(VIN) IC37.7(VIN) J9.2
VIN+ [power]: C121.1 C124.1 L3.2 R73.2 ; also sheet 1
VIN- [power]: C106.2 C108.2 D2.A IC36.6(GND) IC36.9(EP) R117.1 ; also sheet 1
Unconnected: IC36.2(NC_1) IC36.3(NC_2) IC36.5(ENA) IC37.2(NC_1) IC37.3(NC_2) IC37.5(ENA)

### Notes on the sheet
- Vout = (R1/R2 +1) * 1.221 V
          = (10/2 + 1) * 1.221  V = 7.3 V

## Power pins joined to a net without a drawn wire
GND: ARDUINO_NANO1.14(GND)

## Library data of the parts
ARDUINO_NANO1 = ArduinoNanoV30:ARDUINO_NANO: Arduino Nano V3.0 Overview: The Arduino Nano is a small, complete, and breadboard-friendly board based on the ATmega328 (Arduino Nano 3.x) or ATmega168 (Arduino Nano 2.x). It has more or less the same functionality of the Arduino Duemilanove, but in a different package. It lacks only a DC power jack, and works with a Mini-B USB cable instead of a standard one. The Nano was designed and is being produced by Gravitech. Specifications: Microcontroller Atmel ATmega168 or ATmega328 Operating Voltage (logic level) 5 V Input Voltage (recommended) 7-12 V Input Voltage (limits) 6-20 V Digital I/O Pins 14 (of which 6 provide PWM output) Analog Input Pins 8 DC Current per I/O Pin 40 mA Flash Memory 16 KB (ATmega168) or 32 KB (ATmega328) of which 2 KB used by bootloader SRAM 1 KB (ATmega168) or 2 KB (ATmega328) EEPROM 512 bytes (ATmega168) or 1 KB (ATmega328) Clock Speed 16 MHz Dimensions 0.73" x 1.70" Length 45 mm Width 18 mm Weigth 5 g Power: The Arduino Nano can be powered via the Mini-B USB connection, 6-20V unregulated external power supply (pin 30), or 5V regulated external power supply (pin 27). The power source is automatically selected to the highest voltage source. Memory: The ATmega168 has 16 KB of flash memory for storing code (of which 2 KB is used for the bootloader); the ATmega328 has 32 KB, (also with 2 KB used for the bootloader). The ATmega168 has 1 KB of SRAM and 512 bytes of EEPROM (which can be read and written with the EEPROM library); the ATmega328 has 2 KB of SRAM and 1 KB of EEPROM. Input and Output: Each of the 14 digital pins on the Nano can be used as an input or output, using pinMode(), digitalWrite(), and digitalRead() functions. They operate at 5 volts. Each pin can provide or receive a maximum of 40 mA and has an internal pull-up resistor (disconnected by default) of 20-50 kOhms. In addition, some pins have specialized functions. Visit Arduino - ArduinoBoardNano <https://www.arduino.cc/en/Main/ArduinoBoardNano>
C1-C107 C110 C111 C116-C122 = passives:CAPACITOR: 0402 Capacitor
C108 C109 C123-C125 = rcl:C-EU: CAPACITOR, European symbol; SPICEPREFIX: C
D1 D2 = SparkFun-DiscreteSemi:DIODE-SCHOTTKY: Schottky diode A Schottky diode is a semiconductor diode which has a low forward voltage drop and a very fast switching action.; LCSC: C64982; PROD_ID: DIO-09886; VALUE: 3A/40V/500mV
IC1 IC7 = OPA699ID:OPA699ID: Texas Instruments OPA699ID Op Amp, 880MHz, 9 V, 8-Pin SOIC Source: Datasheet <http://www.ti.com/lit/gpn/opa699>; DESCRIPTION: Texas Instruments OPA699ID Op Amp, 880MHz, 9 V, 8-Pin SOIC; HEIGHT: 1.75mm; MANUFACTURER_NAME: Texas Instruments; MANUFACTURER_PART_NUMBER: OPA699ID; MOUSER_PART_NUMBER: 595-OPA699ID; MOUSER_PRICE-STOCK: https://www.mouser.co.uk/ProductDetail/Texas-Instruments/OPA699ID?qs=wgAEGBTxy7n0Nk%252BpyQzyiA%3D%3D
IC2 IC16 = DAC7578SPWR:DAC7578SPWR: 12-bit, Octal Channel, Ultra-Low Glitch, Voltage Output, 2-Wire Interface DAC Source: Datasheet <http://www.ti.com/lit/gpn/DAC7578>; DESCRIPTION: 12-bit, Octal Channel, Ultra-Low Glitch, Voltage Output, 2-Wire Interface DAC; HEIGHT: 1.2mm; MANUFACTURER_NAME: Texas Instruments; MANUFACTURER_PART_NUMBER: DAC7578SPWR; MOUSER_PART_NUMBER: 595-DAC7578SPWR; MOUSER_PRICE-STOCK: https://www.mouser.co.uk/ProductDetail/Texas-Instruments/DAC7578SPWR?qs=EuM%2FBx4ov4Q5WBxZ%252BdwNrg%3D%3D
IC3 IC5 IC33 = LTC6229IMS8E#TRPBF:LTC6229IMS8E#TRPBF: High Speed Operational Amplifiers Prec, Low Drift & Noise Hi Speed Amp Source: Datasheet <https://www.analog.com/media/en/technical-documentation/data-sheets/LTC6228-6229.pdf>; DESCRIPTION: High Speed Operational Amplifiers Prec, Low Drift & Noise Hi Speed Amp; HEIGHT: 1.1mm; MANUFACTURER_NAME: Analog Devices; MANUFACTURER_PART_NUMBER: LTC6229IMS8E#TRPBF; MOUSER_PART_NUMBER: 584-LTC6229IMS8E#TR; MOUSER_PRICE-STOCK: https://www.mouser.co.uk/ProductDetail/Analog-Devices/LTC6229IMS8ETRPBF?qs=BJlw7L4Cy7%252B3qToO7Cz9NQ%3D%3D
IC4 IC6 = OPA695IDR:OPA695IDR: High Speed Operational Amplifiers Ultra-Wideband Curre nt Feedback Source: Datasheet <https://www.ti.com/lit/ds/symlink/opa695.pdf?HQS=dis-dk-null-digikeymode-dsf-pf-null-wwe&ts=1639563683279&ref_url=https%3A%2F%2Fwww.ti.com%2Fgeneral%2Fdocs%2Fsuppproductinfo.tsp%3FdistId%3D10%26gotoUrl%3Dhttps%3A%2F%2Fwww.ti.com%>; DESCRIPTION: High Speed Operational Amplifiers Ultra-Wideband Curre nt Feedback; HEIGHT: 1.75mm; MANUFACTURER_NAME: Texas Instruments; MANUFACTURER_PART_NUMBER: OPA695IDR; MOUSER_PART_NUMBER: 595-OPA695IDR; MOUSER_PRICE-STOCK: https://www.mouser.co.uk/ProductDetail/Texas-Instruments/OPA695IDR?qs=wgAEGBTxy7loIslyoQGyeQ%3D%3D
IC8-IC10 IC27 = SparkFun-IC-Amplifiers:OPAMP-DUAL: Generic op-amp footprint This component is for the standard 358 pinning of a dual op-amp From the LM358 datasheet: Pin 1: Output A Pin 2: Inverting Input A Pin 3: Non-Inverting Input A Pin 4: Gnd Pin 5: Non-Inverting Input B Pin 6: Inverting Input B Pin 7: Output B Pin 8: V+; PROD_ID: NA-XXXXX; VALUE: OP-AMP
IC11 = adafruit:78*: Positive VOLTAGE REGULATOR Added bigger pads to the TO-92 package
IC12-IC15 IC17-IC20 IC28 IC30-IC32 = SN74AUC2G66DCTR:SN74AUC2G66DCTR: Dual Bilateral Analog Switch Source: Datasheet <http://www.ti.com/lit/gpn/sn74auc2g66>; DESCRIPTION: Dual Bilateral Analog Switch; HEIGHT: 1.3mm; MANUFACTURER_NAME: Texas Instruments; MANUFACTURER_PART_NUMBER: SN74AUC2G66DCTR; MOUSER_PART_NUMBER: 595-SN74AUC2G66DCTR; MOUSER_PRICE-STOCK: https://www.mouser.co.uk/ProductDetail/Texas-Instruments/SN74AUC2G66DCTR?qs=X3IDIfI%252BJAXYLrXiJRkcqA%3D%3D
IC21-IC24 IC34 IC35 = 74AUP2GU04GW_125:74AUP2GU04GW,125: Inverters DUAL UNBUFF INVERTER 1.8V Source: Datasheet <https://componentsearchengine.com/Datasheets/1/74AUP2GU04GW,125.pdf>; DESCRIPTION: Inverters DUAL UNBUFF INVERTER 1.8V; HEIGHT: 1.1mm; MANUFACTURER_NAME: Nexperia; MANUFACTURER_PART_NUMBER: 74AUP2GU04GW,125; MOUSER_PART_NUMBER: 771-74AUP2GU04GW-G; MOUSER_PRICE-STOCK: https://www.mouser.com/Search/Refine.aspx?Keyword=771-74AUP2GU04GW-G
IC25 = MC7905ACD2TR4G:MC7905ACD2TR4G: ON SEMICONDUCTOR - MC7905ACD2TR4G - Fixed LDO Voltage Regulator, 7905, -35V in, 1.3V Dropout, -5V/1A out, TO-263-3 Source: Datasheet <https://www.onsemi.com/pdf/datasheet/mc7900-d.pdf>; DESCRIPTION: ON SEMICONDUCTOR - MC7905ACD2TR4G - Fixed LDO Voltage Regulator, 7905, -35V in, 1.3V Dropout, -5V/1A out, TO-263-3; HEIGHT: 4.572mm; MANUFACTURER_NAME: onsemi; MANUFACTURER_PART_NUMBER: MC7905ACD2TR4G; MOUSER_PART_NUMBER: 863-MC7905ACD2TR4G; MOUSER_PRICE-STOCK: https://www.mouser.co.uk/ProductDetail/onsemi/MC7905ACD2TR4G?qs=%252B9%2Fcbd0IE0ROAS%2F2lHbmwg%3D%3D
IC26 = burr-brown:REG1117: 800mA and 1A Low Dropout (LDO) Positive Regulator 1.8V, 2.5V, 2.85V, 3.3V, 5V, and Adj; JLC_ROTATION: 270; MPN: REG1117; OC_FARNELL: 1097566; OC_NEWARK: 14P6981
IC29 = LM337KVURG3:LM337KVURG3: 3 Pin 1.5A Adjustable Negative Voltage Regulator Source: Datasheet <http://www.ti.com/lit/gpn/lm337>; DESCRIPTION: 3 Pin 1.5A Adjustable Negative Voltage Regulator; HEIGHT: 2.65mm; MANUFACTURER_NAME: Texas Instruments; MANUFACTURER_PART_NUMBER: LM337KVURG3; MOUSER_PART_NUMBER: 595-LM337KVURG3; MOUSER_PRICE-STOCK: https://www.mouser.co.uk/ProductDetail/Texas-Instruments/LM337KVURG3?qs=iSMark9AYDXYOGB3Dr0rVg%3D%3D
IC36 IC37 = TPS5430DDAR:TPS5430DDAR: Texas Instruments, TPS5430DDAR Step-Down Switching Regulator 3A Adjustable, 1.22 31 V, 8-Pin SOIC Source: Datasheet <http://www.ti.com/lit/gpn/tps5430>; DESCRIPTION: Texas Instruments, TPS5430DDAR Step-Down Switching Regulator 3A Adjustable, 1.22 31 V, 8-Pin SOIC; HEIGHT: 1.7mm; MANUFACTURER_NAME: Texas Instruments; MANUFACTURER_PART_NUMBER: TPS5430DDAR; MOUSER_PART_NUMBER: 595-TPS5430DDAR; MOUSER_PRICE-STOCK: https://www.mouser.co.uk/ProductDetail/Texas-Instruments/TPS5430DDAR?qs=zwk82MlA57ZJdOTovH1aYA%3D%3D
IO_C10 IO_H4 IO_H5 IO_H34 OPIN PULSESUMOUT = con-coax:BU-SMB-V: FEMALE SMB CONNECTOR Radiall distributor RS 112-2993; OC_FARNELL: unknown; OC_NEWARK: unknown
J1 = SparkFun-Connectors:CONN_08: Multi connection point. Often used as Generic Header-pin footprint for 0.1 inch spaced/style header connections On any of the 0.1 inch spaced packages, you can populate with these: Break Away Headers - Straight <https://www.sparkfun.com/products/116> (PRT-00116) Break Away Male Headers - Right Angle <https://www.sparkfun.com/products/553> (PRT-00553) Female Headers <https://www.sparkfun.com/products/115> (PRT-00115) Break Away Headers - Machine Pin <https://www.sparkfun.com/products/117> (PRT-00117) Break Away Female Headers - Swiss Machine Pin <https://www.sparkfun.com/products/743> (PRT-00743) Arduino Stackable Header - 8 Pin <https://www.sparkfun.com/products/9279> (PRT-09279) For SCREWTERMINALS and SPRING TERMINALS visit here: Screw Terimnals on SparkFun.com <https://www.sparkfun.com/search/results?term=Screw+Terminals> (5mm/3.5mm/2.54mm spacing) This device is also useful as a general connection point to wire up your design to another part of your project. Our various solder wires solder well into these plated through hole pads. Hook-Up Wire - Assortment (Stranded, 22 AWG) <https://www.sparkfun.com/products/11375> (PRT-11375) Hook-Up Wire - Assortment (Solid Core, 22 AWG) <https://www.sparkfun.com/products/11367> (PRT-11367) View the entire wire category on our website here <https://www.sparkfun.com/categories/141> Special notes: Molex polarized connector foot print use with SKU : PRT-08231 with associated crimp pins and housings. 1MM SMD Version SKU: PRT-10208 NOTES ON THE VARIANTS LOCK and LOCK_LONGPADS... This footprint was designed to help hold the alignment of a through-hole component (i.e. 6-pin header) while soldering it into place. You may notice that each hole has been shifted either up or down by 0.005 of an inch from it's more standard position (which is a perfectly straight line). This slight alteration caused the pins (the squares in the middle) to touch the edges of the holes. Because they are alternating, it causes a "brace" to hold the component in place. 0.005 has proven to be the perfect amount of "off-center" position when using our standard breakaway headers. Although looks a little odd when you look at the bare footprint, once you have a header in there, the alteration is very hard to notice. Also,if you push a header all the way into place, it is covered up entirely on the bottom side.; PROD_ID: CONN-08438
J2 = ASP-134604-01:ASP-134604-01: SAMTEC - ASP-134604-01 - Board-To-Board Connector, Vita 57 XMC, 1.27 mm, 160 Contacts, Header, ASP Series, Surface Mount Source: Datasheet <https://componentsearchengine.com/Datasheets/2/ASP-134604-01.pdf>; DESCRIPTION: SAMTEC - ASP-134604-01 - Board-To-Board Connector, Vita 57 XMC, 1.27 mm, 160 Contacts, Header, ASP Series, Surface Mount; HEIGHT: 7.11mm; MANUFACTURER_NAME: SAMTEC; MANUFACTURER_PART_NUMBER: ASP-134604-01; MOUSER_PART_NUMBER: 200-ASP-134604-01; MOUSER_PRICE-STOCK: https://www.mouser.co.uk/ProductDetail/Samtec/ASP-134604-01?qs=Rp%2FUEJiACm00i8g2mQ6XNw%3D%3D
J3 J9 = Seeed-Connector:DIP-BLACK-MALE-HEADER-VERT(2P-2.54): 320020016; MPN: P125-1102A0BS116A1
J5 J8 J12 J13 = Seeed-Connector:DIP-BLACK-FEMALE-HEADER-VERT(4P-2.54): 320030017; MPN: F185-1104A1BSYA1
L1 L2 = SparkFun-Passives:INDUCTOR: Inductors Basic Inductor/Choke - 0603 and 1206. Footprints are not proven and vary greatly between part numbers. INDUCTOR POWER 3.3UH 4.0A SMD 0.197" L x 0.197" W x 0.177" H (5.00mm x 5.00mm x 4.50mm)
L3 L4 = SparkFun-Passives:INDUCTOR: Inductors Basic Inductor/Choke - 0603 and 1206. Footprints are not proven and vary greatly between part numbers. INDUCTOR POWER 3.3UH 4.0A SMD 0.197" L x 0.197" W x 0.177" H (5.00mm x 5.00mm x 4.50mm); LCSC: C339970
R1-R8 R10-R118 = passives:RESISTOR: Resistor Basic schematic elements and footprints for 0603, 1206, and PTH resistors.
R9 = rcl:R-US_: RESISTOR, American symbol; SPICEPREFIX: R
SV1 SV2 = con-lsta:FE20-1: FEMALE HEADER; OC_FARNELL: unknown; OC_NEWARK: unknown

## Net classes
0 default: width 0.305 mm
1 power: width 0.406 mm
2 gnd: width 0.305 mm